# Altium schematic sheet PIC18F2550.SchDoc
size A4; SheetNumber: 1; SheetTotal: 1
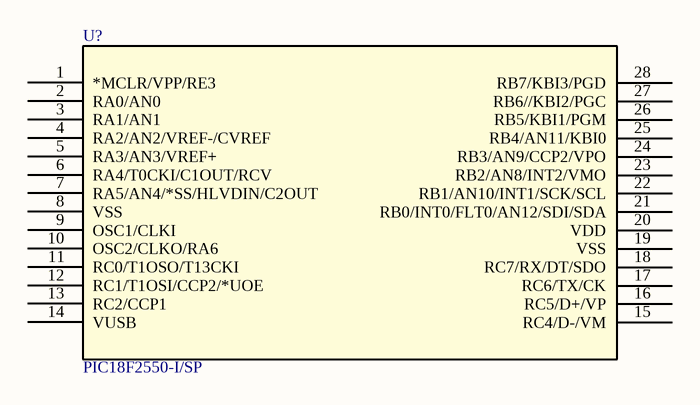
[diagram p0: PIC18F2550.SchDoc]

## Parts
U?  PIC18F2550-I/SP  [PIC18F2550-I/SP]

## Nets

Not connected (* = marked no-connect by the designer): U? 1(*MCLR/VPP/RE3) 2(RA0/AN0) 3(RA1/AN1) 4(RA2/AN2/VREF-/CVREF) 5(RA3/AN3/VREF+) 6(RA4/T0CKI/C1OUT/RCV) 7(RA5/AN4/*SS/HLVDIN/C2OUT) 8(VSS) 9(OSC1/CLKI) 10(OSC2/CLKO/RA6) 11(RC0/T1OSO/T13CKI) 12(RC1/T1OSI/CCP2/*UOE) 13(RC2/CCP1) 14(VUSB) 15(RC4/D-/VM) 16(RC5/D+/VP) 17(RC6/TX/CK) 18(RC7/RX/DT/SDO) 19(VSS) 20(VDD) 21(RB0/INT0/FLT0/AN12/SDI/SDA) 22(RB1/AN10/INT1/SCK/SCL) 23(RB2/AN8/INT2/VMO) 24(RB3/AN9/CCP2/VPO) 25(RB4/AN11/KBI0) 26(RB5/KBI1/PGM) 27(RB6//KBI2/PGC) 28(RB7/KBI3/PGD)

## Library data of the parts
U? = PIC18F2550-I/SP: Microcontroller, 32 Kb Flash, 2048 Ram, 256 EEPROM, 24 I/o, SPDIP-28; Mfr_Name: Microchip; Min Supply Voltage: 4.2V; Max Supply Voltage: 5.5V; Number of PWM Channels: 2; RAM Size: 2KB; Number of Timers/Counters: 4; Number of ADC Channels: 10; Interface: I2C,SPI,USB,UART,USART; Frequency: 48MHz; Number of I/Os: 24; Max Power Dissipation: 1W; Density: 32KB; Data Bus Width: 8b; Number of SPI Channels: 1; Oscillator Type: Internal; Watchdog Timer: Yes; Peripherals: PWM,Brown-out Detect/Reset,POR,WDT,HLVD,I2C; Core Architecture: PIC; Number of Bits: 8; Nominal Supply Current: 1.1mA; Access Time: 48us; Copyright: Copyright (C) 2023 Ultra Librarian. All rights reserved.; Manufacturer_Part_Number: PIC18F2550-I/SP; RefDes: RefDes; Type: DEV; Supplier 1: Digi-Key; Supplier Part Number 1: PIC18F2550-I/SP-ND; Manufacturer: Microchip; Manufacturer Part Number: PIC18F2550-I/SP; RoHS: Yes; Category: Microcontrollers; Stock 1: 2922; Pricing 1: 1=8.04000 (USD); Mount: Through Hole; Case/Package: DIP; Number of Pins: 28; Weight: 0.02lb; Min Operating Temperature: -40°C; Max Operating Temperature: 85°C; Packaging: Rail/Tube; Package Quantity: 15; Number of Programmable I/O: 24; Max Frequency: 48MHz; Number of I2C Channels: 1; Memory Type: FLASH; Memory Size: 32KB; Number of UART Channels: 1; Address Bus Width: 8b; Number of A/D Converters: 1; Supply Current: 1.1mA; Length: 35.56mm; Width: 0.295inch; Height: 0.15inch; Radiation Hardening: No; Reach SVHC Compliant: Yes; Lead Free: Lead Free; RoHS Compliant: Yes; ComponentLink1URL: https://datasheet.ciiva.com/19459/2177651-19459972.pdf?src-supplier=Jameco; ComponentLink1Description: https://datasheet.ciiva.com/19459/2177651-19459972.pdf?src-supplier=Jameco; ComponentLink2URL: https://datasheet.ciiva.com/14131/cepic18f25-data-en-14131789.pdf?src-supplier=Distrelec; ComponentLink2Description: https://datasheet.ciiva.com/14131/cepic18f25-data-en-14131789.pdf?src-supplier=Distrelec; ComponentLink3URL: https://datasheet.ciiva.com/7774/39632e-7774525.pdf?src-supplier=Element14; ComponentLink3Description: https://datasheet.ciiva.com/7774/39632e-7774525.pdf?src-supplier=Element14; ComponentLink4URL: https://datasheet.ciiva.com/7180/720550-7180953.pdf?src-supplier=Newark; ComponentLink4Description: https://datasheet.ciiva.com/7180/720550-7180953.pdf?src-supplier=Newark; ComponentLink5URL: https://datasheet.ciiva.com/9244/39632d-9244668.pdf?src-supplier=Avnet; ComponentLink5Description: https://datasheet.ciiva.com/9244/39632d-9244668.pdf?src-supplier=Avnet; ComponentLink6URL: https://datasheet.ciiva.com/1494/39632e-1494161.pdf?src-supplier=Digi-Key; ComponentLink6Description: https://datasheet.ciiva.com/1494/39632e-1494161.pdf?src-supplier=Digi-Key